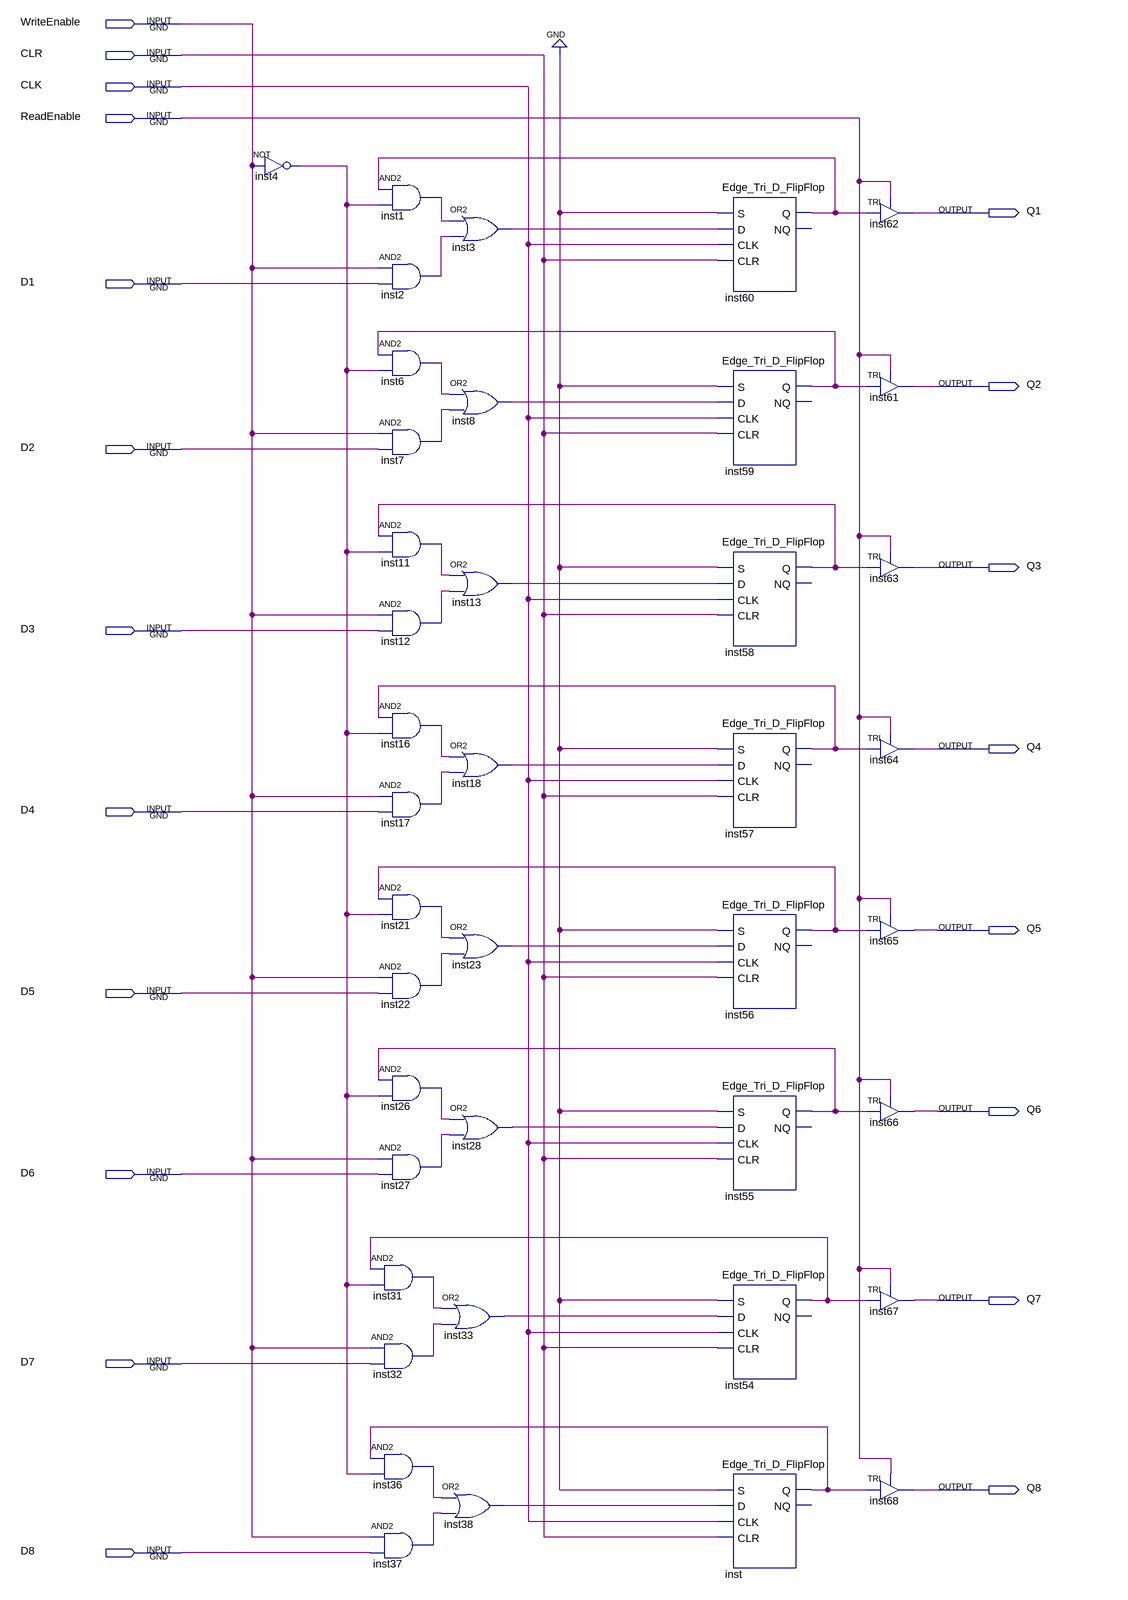
[diagram p0: schematic sheet]
// Quartus schematic Register.bdf as structural Verilog: 41 symbols, 20 pins
module Register (
  input  WriteEnable,
  input  CLR,
  input  CLK,
  input  ReadEnable,
  input  D1,
  input  D2,
  input  D3,
  input  D4,
  input  D5,
  input  D6,
  input  D7,
  input  D8,
  output Q1,
  output Q2,
  output Q3,
  output Q4,
  output Q5,
  output Q6,
  output Q7,
  output Q8
);

  wire inst1_out, inst2_out, inst3_out, inst4_out, inst6_out, inst7_out, inst8_out, inst11_out, inst12_out,
       inst13_out, inst16_out, inst17_out, inst18_out, inst21_out, inst22_out, inst23_out, inst26_out,
       inst27_out, inst28_out, inst31_out, inst32_out, inst33_out, inst36_out, inst37_out, inst38_out,
       inst54_q, inst55_q, inst56_q, inst57_q, inst58_q, inst59_q, inst60_q, inst_q;

  not inst4 (inst4_out, WriteEnable);
  and inst1 (inst1_out, inst60_q, inst4_out);
  and inst2 (inst2_out, WriteEnable, D1);
  and inst6 (inst6_out, inst59_q, inst4_out);
  and inst7 (inst7_out, WriteEnable, D2);
  and inst11 (inst11_out, inst58_q, inst4_out);
  and inst12 (inst12_out, WriteEnable, D3);
  and inst16 (inst16_out, inst57_q, inst4_out);
  and inst17 (inst17_out, WriteEnable, D4);
  and inst21 (inst21_out, inst56_q, inst4_out);
  and inst22 (inst22_out, WriteEnable, D5);
  and inst26 (inst26_out, inst55_q, inst4_out);
  and inst27 (inst27_out, WriteEnable, D6);
  and inst31 (inst31_out, inst54_q, inst4_out);
  and inst32 (inst32_out, WriteEnable, D7);
  and inst36 (inst36_out, inst_q, inst4_out);
  and inst37 (inst37_out, WriteEnable, D8);
  or inst3 (inst3_out, inst1_out, inst2_out);
  or inst8 (inst8_out, inst6_out, inst7_out);
  or inst13 (inst13_out, inst11_out, inst12_out);
  or inst18 (inst18_out, inst16_out, inst17_out);
  or inst23 (inst23_out, inst21_out, inst22_out);
  or inst28 (inst28_out, inst26_out, inst27_out);
  or inst33 (inst33_out, inst31_out, inst32_out);
  or inst38 (inst38_out, inst36_out, inst37_out);
  Edge_Tri_D_FlipFlop inst60 (.S(1'b0), .D(inst3_out), .CLK(CLK), .CLR(CLR), .Q(inst60_q));  // open: NQ
  Edge_Tri_D_FlipFlop inst59 (.S(1'b0), .D(inst8_out), .CLK(CLK), .CLR(CLR), .Q(inst59_q));  // open: NQ
  Edge_Tri_D_FlipFlop inst58 (.S(1'b0), .D(inst13_out), .CLK(CLK), .CLR(CLR), .Q(inst58_q));  // open: NQ
  Edge_Tri_D_FlipFlop inst57 (.S(1'b0), .D(inst18_out), .CLK(CLK), .CLR(CLR), .Q(inst57_q));  // open: NQ
  Edge_Tri_D_FlipFlop inst56 (.S(1'b0), .D(inst23_out), .CLK(CLK), .CLR(CLR), .Q(inst56_q));  // open: NQ
  Edge_Tri_D_FlipFlop inst55 (.S(1'b0), .D(inst28_out), .CLK(CLK), .CLR(CLR), .Q(inst55_q));  // open: NQ
  Edge_Tri_D_FlipFlop inst54 (.S(1'b0), .D(inst33_out), .CLK(CLK), .CLR(CLR), .Q(inst54_q));  // open: NQ
  Edge_Tri_D_FlipFlop inst (.S(1'b0), .D(inst38_out), .CLK(CLK), .CLR(CLR), .Q(inst_q));  // open: NQ
  TRI inst62 (.IN(inst60_q), .OE(ReadEnable), .OUT(Q1));
  TRI inst61 (.IN(inst59_q), .OE(ReadEnable), .OUT(Q2));
  TRI inst63 (.IN(inst58_q), .OE(ReadEnable), .OUT(Q3));
  TRI inst64 (.IN(inst57_q), .OE(ReadEnable), .OUT(Q4));
  TRI inst65 (.IN(inst56_q), .OE(ReadEnable), .OUT(Q5));
  TRI inst66 (.IN(inst55_q), .OE(ReadEnable), .OUT(Q6));
  TRI inst67 (.IN(inst54_q), .OE(ReadEnable), .OUT(Q7));
  TRI inst68 (.IN(inst_q), .OE(ReadEnable), .OUT(Q8));
endmodule
